# Altium schematic sheet lv_io_current.SchDoc
size A4; Organization: Badgerloop; Address1: 133 Engineering Research; Address2: Building; Address3: Madison, WI 53715
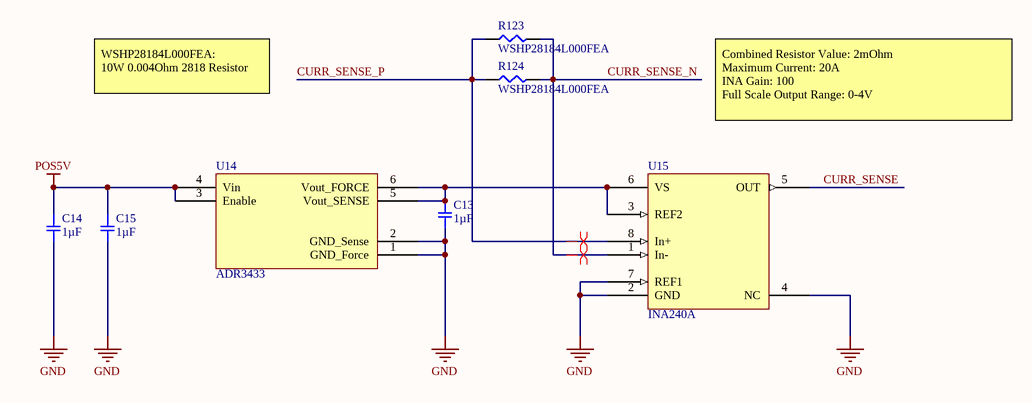
[diagram p0: lv_io_current.SchDoc]

## Parts
C13  1µF  [SMD-0805C]
C14  1µF  [SMD-0805C]
C15  1µF  [SMD-0805C]
R123  WSHP28184L000FEA  [RESC7146X15N]
R124  WSHP28184L000FEA  [RESC7146X15N]
U14  ADR3433  [SOT95P280X145-6N]
U15  INA240A  [SOIC127P600X175-8N]

## Nets
GND: C13.2 C14.2 C15.2 U14.1(GND_Force) U14.2(GND_Sense) U15.2(GND) U15.4(NC) U15.7(REF1)
POS5V: C14.1 C15.1 U14.3(Enable) U14.4(Vin)
CURR_SENSE: U15.5(OUT)
CURR_SENSE_N: R123.2 R124.2 U15.1(In-)
CURR_SENSE_P: R123.1 R124.1 U15.8(In+)
NetC13_1: C13.1 U14.5(Vout_SENSE) U14.6(Vout_FORCE) U15.3(REF2) U15.6(VS)

## Layout directives
differential pair: CURR_SENSE_N, CURR_SENSE_P

## Notes on the sheet
- WSHP28184L000FEA:
  10W 0.004Ohm 2818 Resistor
- Combined Resistor Value: 2mOhm
  Maximum Current: 20A
  INA Gain: 100
  Full Scale Output Range: 0-4V
  Maximum Power Dissipation 0.45W
- Title
- Size:
- Date:
- A4
- Number:
- Time:
- Revision:
- Sheet
- of
- File:

## Library data of the parts
C13-C15 = GCJ21BR71E105KA12L: CAP CER 1UF 25V X7R 0805; Manufacturer: Murata Electronics North America; Factory Stock: 0; Unit Price (USD): 0.36; Minimum Quantity: 1; Tolerance: ±10%; Datasheets: http://www.murata.com/~/media/webrenewal/support/library/catalog/products/capacitor/mlcc/c03e.ashx; Image: //media.digikey.com/Renders/Murata%20Renders/0805%20(2012%20Metric)%20.85mm.jpg; Digikey P/N: 490-5802-1-ND; Part Number: GCJ21BR71E105KA12L; Quantity Available: 15950; @ qty: 0; Packaging: Cut Tape (CT); Series: GCJ; Part Status: Active; Value: 1µF; Voltage: 25V; Temperature Coefficient: X7R; Operating Temperature: -55°C ~ 125°C; Features: Soft Termination; Ratings: AEC-Q200; Applications: Automotive, Boardflex Sensitive; Mounting Type: Surface Mount, MLCC; Package / Case: 0805 (2012 Metric); Size / Dimension: 0.079" L x 0.049" W (2.00mm x 1.25mm); Height - Seated (Max): -; Thickness (Max): 0.057" (1.45mm); Lead Spacing: -; Lead Style: -
R123 R124 = WSHP28184L000FEA: RES 0.004 OHM 1% 10W 2818; Manufacturer: Vishay Dale; Digikey Link: https://www.digikey.com/product-detail/en/vishay-dale/WSHP28184L000FEA/541-3274-1-ND/6605250; Digikey P/N: 541-3274-1-ND; Manufacturer P/N: WSHP28184L000FEA
U14 = ADR3433: IC VREF SERIES 3.3V SOT23-6; Manufacturer: Analog Devices; Manufacturer P/N: ADR3433ARJZ-R7; ComponentLink1Description: Digikey; ComponentLink1URL: https://www.digikey.com/product-detail/en/analog-devices-inc/ADR3433ARJZ-R7/ADR3433ARJZ-R7CT-ND/4909083; Digikey Link: https://www.digikey.com/product-detail/en/analog-devices-inc/ADR3433ARJZ-R7/ADR3433ARJZ-R7CT-ND/4909083; Digikey P/N: ADR3433ARJZ-R7CT-ND
U15 = INA240A: IC AMP CURRENT SENSE 8-TSSOP; Manufacturer: TI; Manufacturer P/N: INA240A1PWR; Digikey P/N: 296-45088-1-ND; Digikey Link: https://www.digikey.com/product-detail/en/texas-instruments/INA240A1PWR/296-45088-1-ND/6562101